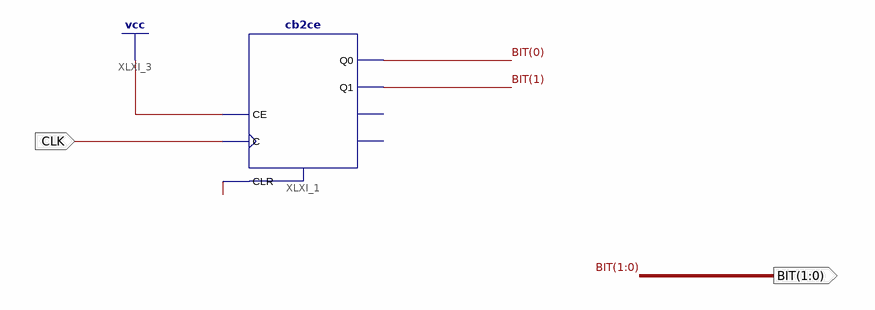
[diagram p0: schematic sheet 1]
// Xilinx ISE schematic COUNTER_4.sch (spartan6) as structural Verilog: 1 symbols, 2 ports
module COUNTER_4 (
  input  CLK,
  output [1:0] BIT
);

  wire XLXN_2;

  cb2ce XLXI_1 (.C(CLK), .CE(1'b1), .CLR(XLXN_2), .Q0(BIT[0]), .Q1(BIT[1]));  // open: CEO, TC
endmodule
